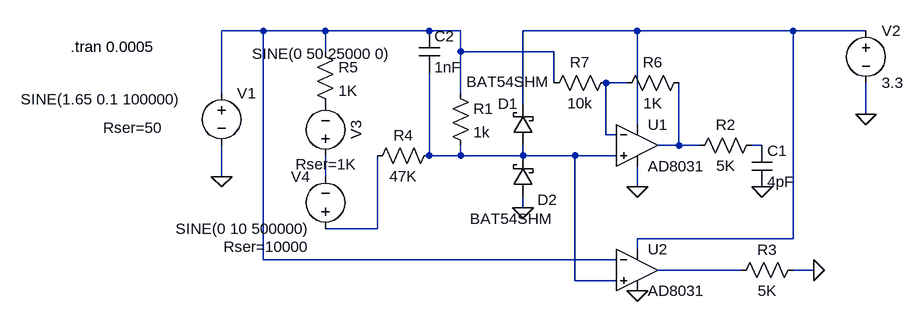
[diagram p0: schematic vr_input.asc]
vr_input.asc, the LTspice schematic file:
Version 4
SHEET 1 880 680
WIRE -272 -80 -336 -80
WIRE -176 -80 -272 -80
WIRE -16 -80 -176 -80
WIRE 32 -80 -16 -80
WIRE 304 -80 128 -80
WIRE 544 -80 304 -80
WIRE 656 -80 544 -80
WIRE -176 -48 -176 -80
WIRE 32 -48 32 -80
WIRE 176 -48 32 -48
WIRE 176 0 176 -48
WIRE 288 0 256 0
WIRE -336 16 -336 -80
WIRE 32 16 32 -48
WIRE 128 32 128 -80
WIRE 656 48 656 0
WIRE 304 64 304 -80
WIRE 256 80 256 0
WIRE 272 80 256 80
WIRE 368 96 368 0
WIRE 368 96 336 96
WIRE 400 96 368 96
WIRE 496 96 480 96
WIRE -16 112 -16 -16
WIRE 32 112 32 96
WIRE 32 112 -16 112
WIRE 128 112 128 96
WIRE 128 112 32 112
WIRE 208 112 128 112
WIRE 272 112 208 112
WIRE -336 144 -336 96
WIRE -176 144 -176 112
WIRE 304 160 304 128
WIRE 128 192 128 176
WIRE -96 224 -96 112
WIRE -96 224 -176 224
WIRE 544 240 544 -80
WIRE 544 240 304 240
WIRE 304 256 304 240
WIRE -272 272 -272 -80
WIRE 272 272 -272 272
WIRE 464 288 336 288
WIRE 576 288 544 288
WIRE 208 304 208 112
WIRE 272 304 208 304
FLAG 304 160 0
FLAG 656 48 0
FLAG -336 144 0
FLAG 128 192 0
FLAG 304 320 0
FLAG 576 288 0
FLAG 496 160 0
SYMBOL voltage -336 0 R0
WINDOW 123 0 0 Left 0
WINDOW 39 -182 69 Left 2
WINDOW 3 -309 25 Left 2
SYMATTR SpiceLine Rser=50
SYMATTR InstName V1
SYMATTR Value SINE(1.65 0.1 100000)
SYMBOL voltage 656 -96 R0
WINDOW 123 0 0 Left 0
WINDOW 39 0 0 Left 0
SYMATTR InstName V2
SYMATTR Value 3.3
SYMBOL voltage -176 128 R180
WINDOW 0 -32 56 VBottom 2
WINDOW 3 6 157 Top 2
WINDOW 123 0 0 Left 0
WINDOW 39 -1 -13 Top 2
SYMATTR InstName V3
SYMATTR Value SINE(0 50 25000 0)
SYMATTR SpiceLine Rser=1K
SYMBOL res 496 80 R90
WINDOW 0 0 56 VBottom 2
WINDOW 3 32 56 VTop 2
SYMATTR InstName R2
SYMATTR Value 5K
SYMBOL res 0 96 R90
WINDOW 0 0 56 VBottom 2
WINDOW 3 32 56 VTop 2
SYMATTR InstName R4
SYMATTR Value 47K
SYMBOL schottky 144 96 R180
WINDOW 0 24 64 Left 2
WINDOW 3 -24 98 Left 2
SYMATTR InstName D1
SYMATTR Value BAT54SHM
SYMATTR Description Diode
SYMATTR Type diode
SYMBOL schottky 144 176 R180
WINDOW 0 -37 -4 Left 2
WINDOW 3 -29 -33 Left 2
SYMATTR InstName D2
SYMATTR Value BAT54SHM
SYMATTR Description Diode
SYMATTR Type diode
SYMBOL res 16 0 R0
SYMATTR InstName R1
SYMATTR Value 1k
SYMBOL Opamps\\AD8031 304 32 R0
SYMATTR InstName U1
SYMBOL Opamps\\AD8031 304 224 R0
SYMATTR InstName U2
SYMBOL res 560 272 R90
WINDOW 0 0 56 VBottom 2
WINDOW 3 32 56 VTop 2
SYMATTR InstName R3
SYMATTR Value 5K
SYMBOL cap 480 96 R0
SYMATTR InstName C1
SYMATTR Value 4pF
SYMBOL res -192 -64 R0
SYMATTR InstName R5
SYMATTR Value 1K
SYMBOL cap -32 -80 R0
SYMATTR InstName C2
SYMATTR Value 1nF
SYMBOL voltage -176 240 R180
WINDOW 0 24 96 Left 2
WINDOW 3 24 16 Left 2
WINDOW 123 0 0 Left 0
WINDOW 39 24 -12 Left 2
SYMATTR InstName V4
SYMATTR Value SINE(0 10 500000)
SYMATTR SpiceLine Rser=10000
SYMBOL res 384 -16 R90
WINDOW 0 0 56 VBottom 2
WINDOW 3 32 56 VTop 2
SYMATTR InstName R6
SYMATTR Value 1K
SYMBOL res 272 -16 R90
WINDOW 0 0 56 VBottom 2
WINDOW 3 32 56 VTop 2
SYMATTR InstName R7
SYMATTR Value 10k
TEXT -568 -56 Left 2 !.tran 0.0005

The netlist it stands for:
* vr_input.asc
V1 N001 0 SINE(1.65 0.1 100000) Rser=50
V2 N002 0 3.3
V3 N007 P001 SINE(0 50 25000 0) Rser=1K
R2 N005 N004 5K
R4 N006 N008 47K
D1 N006 N002 BAT54SHM
D2 0 N006 BAT54SHM
R1 N001 N006 1k
XU1 N006 N003 N002 0 N004 AD8031  ; pins In+ In- V+ V- OUT
XU2 N006 N001 N002 0 N009 AD8031  ; pins In+ In- V+ V- OUT
R3 0 N009 5K
C1 N005 0 4pF
R5 N001 P001 1K
C2 N001 N006 1nF
V4 N008 N007 SINE(0 10 500000) Rser=10000
R6 N004 N003 1K
R7 N003 N001 10k
.model D D
.lib standard.dio
.tran 0.0005
.backanno
.end